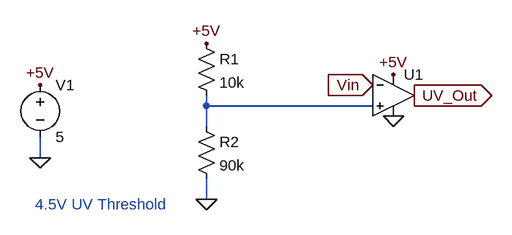
[diagram p0: schematic Draft2.asc]
Draft2.asc, the LTspice schematic file:
Version 4
SHEET 1 880 680
WIRE 144 192 144 176
WIRE 400 192 144 192
WIRE 144 224 144 192
WIRE -112 272 -112 240
WIRE 144 336 144 304
FLAG 144 336 0
FLAG -112 272 0
FLAG -112 160 +5V
FLAG 144 96 +5V
FLAG 432 208 0
FLAG 432 144 +5V
FLAG 400 160 Vin
IOPIN 400 160 In
FLAG 464 176 UV_Out
IOPIN 464 176 Out
SYMBOL res 128 80 R0
SYMATTR InstName R1
SYMATTR Value 10k
SYMBOL res 128 208 R0
SYMATTR InstName R2
SYMATTR Value 90k
SYMBOL voltage -112 144 R0
WINDOW 123 0 0 Left 0
WINDOW 39 0 0 Left 0
SYMATTR InstName V1
SYMATTR Value 5
SYMBOL OpAmps\\UniversalOpAmp2 432 176 R0
SYMATTR InstName U1
TEXT -120 344 Left 2 ;4.5V UV Threshold

The netlist it stands for:
* Draft2.asc
R1 +5V N001 10k
R2 N001 0 90k
V1 +5V 0 5
XU1 N001 Vin +5V 0 UV_Out level2 Avol=1Meg GBW=10Meg Slew=10Meg Ilimit=25m Rail=0 Vos=0 En=0 Enk=0 In=0 Ink=0 Rin=500Meg  ; pins In+ In- V+ V- OUT
* 4.5V UV Threshold
.lib UniversalOpAmp2.lib
.backanno
.end